# Altium schematic sheet CONNECTORS.SchDoc: Connectors
size A4; Date: *******; ApprovedBy: *******; Author: *******; CompanyName: *******; Engineer: *******; Organization: *******; Address1: *******; Address2: *******; Address3: *******; Address4: *******; DocumentNumber: 4; Revision: *******; SheetNumber: 4; SheetTotal: 4; CurrentTime: *******; CurrentDate: *******; Time: *******; DocumentFullPathAndName: *******; DocumentName: *******; ModifiedDate: *******; ImagePath: *******; ProjectName: *******; Application_BuildNumber: *******
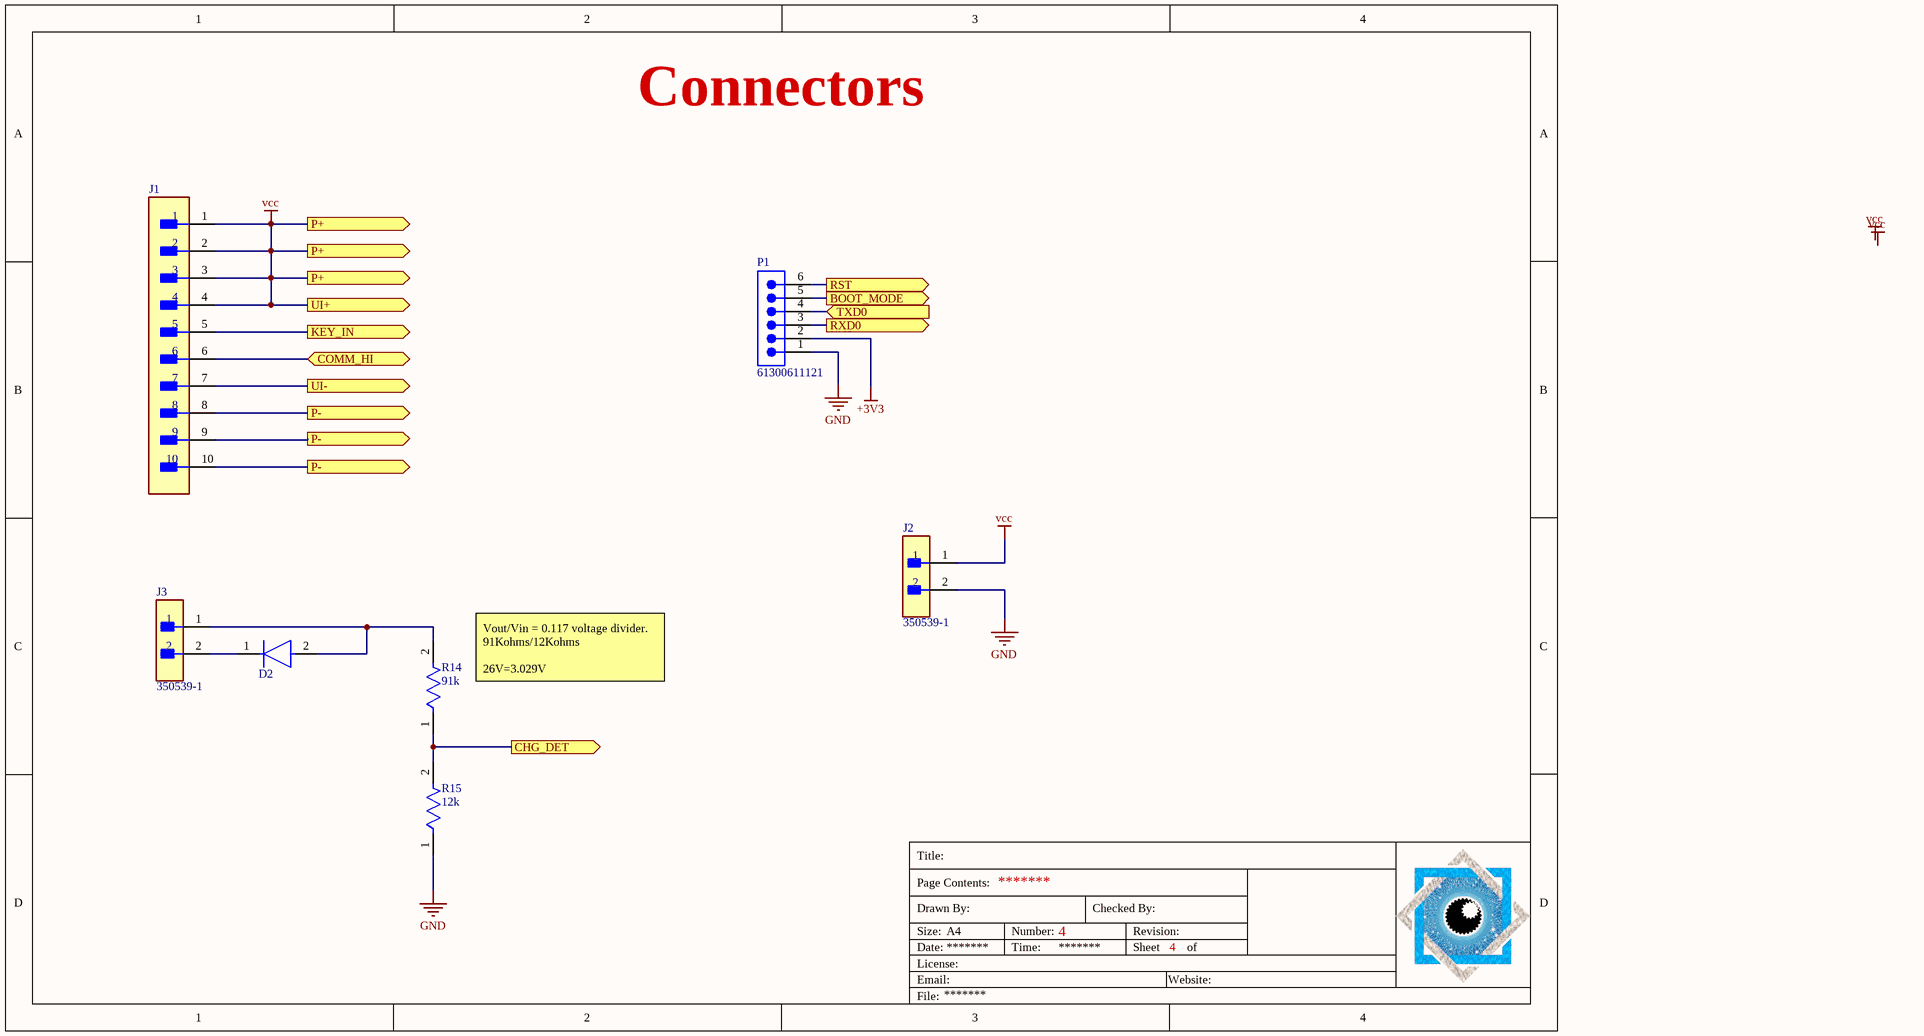
[diagram p0: CONNECTORS.SchDoc]

## Parts
D2  ES2DA-13-F  [FP-SMA-MFG]  (value not drawn)
J1  S10B-PH-K-S(LF)(SN)  [FP-S10B-PH-K-S_LF_SN-MFG]  (value not drawn)
J2  350539-1  [FP-350539-1-MFG]
J3  350539-1  [FP-350539-1-MFG]
P1  61300611121  [61300611121]
R14  91k  [FP-RP731J-MFG]
R15  12k  [FP-RP731J-MFG]

## Ports
BOOT_MODE (out, see MCU[2B]), CHG_DET (out, see MCU[2C]), COMM_HI (bidir, see COMM LEVEL SHIFTER[3B]), KEY_IN (out, see MCU[2C]), P+ (out, see CONNECTORS[1A]), P+ (out, see CONNECTORS[1A], CONNECTORS[1B]), P- (out, see CONNECTORS[1B], POWER[2B]), RST (out, see MCU[3B]), RXD0 (out, see MCU[3B]), TXD0 (in, see MCU[3B]), UI+ (out), UI- (out, see POWER[2C])

## Nets
+3V3: P1.2
GND: J2.2 P1.1 R15.1
vcc: J1.1 J1.2 J1.3 J1.4 J2.1 ; port P+, port UI+
BOOT_MODE: P1.5 ; port BOOT_MODE
CHG_DET: R14.1 R15.2 ; port CHG_DET
COMM_HI: J1.6 ; port COMM_HI
KEY_IN: J1.5 ; port KEY_IN
P-: J1.8 J1.9 J1.10 ; port P-
RST: P1.6 ; port RST
RXD0: P1.3 ; port RXD0
TXD0: P1.4 ; port TXD0
UI-: J1.7 ; port UI-
NetD2_1: D2.1(C) J3.2
NetD2_2: D2.2(A) J3.1 R14.2

## Notes on the sheet
- (near R14) Vout/Vin = 0.117 voltage divider. 91Kohms/12Kohms
  26V=3.029V
- Labels drawn without touching a wire or pin: vcc
- Title:
- Drawn By:
- Page Contents:
- Checked By:
- Size:
- Date:
- File:
- License:
- Email:
- A4
- Number:
- Time:
- Revision:
- Sheet
- Website:
- of

## Library data of the parts
D2 = CMP-12791-000014-1: DIODE GEN PURP 200V 2A SMA; Manufacturer: Diodes Inc.; Value: 25pF; Peak Reverse Current: 5uA; Max Surge Forward Current: 50A; Max Junction Temp: +150°C; Description: 200V 2A Surface Mount Super-Fast Rectifier DO-214AC; Standoff Height: 0.05mm; Forward Current: 2A; Temperature Range High: +150°C; ComponentLink2Description: Datasheet; Footprint Url: https://www.diodes.com/assets/Package-Files/SMA.pdf; ComponentLink2URL: https://www.diodes.com/assets/Datasheets/ds14002.pdf; Max Repetitive Reverse Voltage: 200V; Lead Free: Yes; RoHS: TRUE; Category: Diode; Manufacturer Part Number: ES2DA-13-F; Mouser Description: Rectifiers RECTIFIER SUPER FAST "F" LEAD FREE; Temperature: -55°C to +150°C; Digikey Description: DIODE GEN PURP 200V 2A SMA; Automotive: No; Capacitance: 25pF; Device Class L1: Discrete Semiconductors; Height: 2.4mm; Reverse Voltage: 200V; Octopart: https://octopart.com/es2da-13-f-diodes+inc.-328903; Temperature Range Low: -55°C; Device Class L2: Diodes; Package: SMA; Device Class L3: Rectifier Diodes; LCSC Part #: C5140013
J1 = CMP-17439-000377-2: CONN HEADER R/A 10POS 2MM; Number of Positions: 10; Contact Resistance: 20mR; Gender: Male; Max Current Rating: 2A; Max Voltage Rating (AC): 100V; Number of Pins: 10; Connector Type: Header; Termination: Solder; Number of Rows: 1; Insulation Color: Natural; Flammability Rating: UL94 V-0; Contact Plating: Copper; Packaging: Bulk; Width: 4.5mm; Depth: 7.6mm; Max Operating Temperature: 85°C; Lead Free: Lead Free; Min Operating Temperature: -25°C; Contact Mating Length: 0.13inch; Number of Contacts: 10; Contact Material: Brass; Mount: Through Hole; Contact Shape: Square; Housing Color: White; Orientation: Right Angle; Series: PH; Voltage Rating: 100V; Color: Natural; Insulation Material: Nylon; Housing Material: Polyamide; Current Rating: 2A; Height: 9.4mm; Pitch: 2mm; Contact Finish - Mating: TIN; Length: 21.9mm; Fastening Type: Detent; Contact Type: Male Pin
J2 J3 = CMP-03369-000078-1: CONN HEADER VERT 2POS 5.08MM; Manufacturer: TE Connectivity; Current Rating: 12A; Conn Orientation: Vertical; Number Of Contacts: 2; Conn Gender: Male; Standoff Height: 0.025inch; Voltage Rating: 250V; Description: CONN HEADER 2POS VERT .200 TIN; Category: Conn; Height: 0.41inch; Device Class L3: unset; Number Of Rows: 1; Temperature: -55°C to +105°C; ComponentLink2URL: https://www.te.com/usa-en/product-350539-1.html?te_bu=Cor&te_type=other&te_campaign=oct_glo_cor-oct-global-oth-prtnr-fy19-oct-octo-buy-bom_sma-298_2&elqCampaignId=35216; Manufacturer Part Number: 350539-1; Automotive: No; Mouser Description: Pin & Socket Connectors CONN PCM 2 POS TIN; ComponentLink2Description: Datasheet; Lead Free: Yes; Device Class L1: Connectors; Device Class L2: Headers and Wire Housings; Octopart: https://octopart.com/350539-1-te+connectivity-46510628; Digikey Description: CONN HEADER VERT 2POS 5.08MM; RoHS: TRUE; Temperature Range Low: -55°C; Package: 350539-1; Temperature Range High: +105°C; Contact Material: Gold,Nickel; Pitch: 5.08mm
P1 = CMP-1502-01070-2: NexarPartId: 20084590; Operating Supply Voltage: 250V; Current Rating: 3A; Number of Contacts: 6; Gender: Male; Connector Type: Male Pin; Pitch: 2.54mm; Contact Resistance: 20mΩ; Lead Free: Lead Free; REACH SVHC: Unknown; Number of Rows: 1; Color: Black; Min Operating Temperature: -40°C; Contact Material: Copper; Lead Pitch: 2.54mm; Contact Plating: Gold; Number of Pins: 6; Height: 8.89mm; Orientation: Vertical; Termination: Through Hole; Mount: Through Hole; RoHS: Compliant; Contact Gender: Male; Contact Mating Length: 5.9944mm; Voltage Rating: 250V; Number of Positions: 6; Housing Material: PBT; Packaging: Bulk; Max Operating Temperature: 105°C
R14 = CMP-03211-008596-1: TE CONNECTIVITY / HOLSWORTHY SMD Chip Resistor, Thin Film, 8.45Ω, 50 V, 0603 [1608 Metric], 100 mW, 0.1% , RP73 Series; Manufacturer Part Number: RP73D1J8R45BTDG; Temperature Coefficient: 15ppm/°C; Resistance: 91kΩ; Voltage Rating: 75V; Value: 91kΩ; Power Rating: 0.1W; Temperature: -55°C to +105°C; octopart_url: https://octopart.com/rp73d1j8r45btdg-te+connectivity-42630912; packaging: cut tape; Manufacturer: TE Connectivity; Device Class L2: Resistors; Series: RP73; Temperature Range High: +105°C; Package: 603; ComponentLink2Description: Datasheet; Octopart: https://octopart.com/rp73d1j8r45btdg-te+connectivity-42630912; Height: 0.55mm; Ipc Land Pattern Name: RESC15580X45; ComponentLink2URL: https://www.te.com/commerce/DocumentDelivery/DDEController?Action=srchrtrv&DocNm=1773272&DocType=DS&DocLang=English; Device Class L3: Chip SMD Resistors; Category: Res; Temperature Range Low: -55°C; RoHS: TRUE; Device Class L1: Passive Components; Tolerance: 0.1%; Composition: Thin Film; Automotive: No; Lead Free: Yes; Case/Package: 603; LCSC Part #: *
R15 = CMP-03211-008596-1: TE CONNECTIVITY / HOLSWORTHY SMD Chip Resistor, Thin Film, 8.45Ω, 50 V, 0603 [1608 Metric], 100 mW, 0.1% , RP73 Series; Manufacturer Part Number: RP73D1J8R45BTDG; Temperature Coefficient: 15ppm/°C; Resistance: 12kΩ; Voltage Rating: 75V; Value: 12kΩ; Power Rating: 0.1W; Temperature: -55°C to +105°C; octopart_url: https://octopart.com/rp73d1j8r45btdg-te+connectivity-42630912; packaging: cut tape; Manufacturer: TE Connectivity; Device Class L2: Resistors; Series: RP73; Temperature Range High: +105°C; Package: 603; ComponentLink2Description: Datasheet; Octopart: https://octopart.com/rp73d1j8r45btdg-te+connectivity-42630912; Height: 0.55mm; Ipc Land Pattern Name: RESC15580X45; ComponentLink2URL: https://www.te.com/commerce/DocumentDelivery/DDEController?Action=srchrtrv&DocNm=1773272&DocType=DS&DocLang=English; Device Class L3: Chip SMD Resistors; Category: Res; Temperature Range Low: -55°C; RoHS: TRUE; Device Class L1: Passive Components; Tolerance: 0.1%; Composition: Thin Film; Automotive: No; Lead Free: Yes; Case/Package: 603; LCSC Part #: *